# EAGLE design Robot arm (EAGLE 7.6.0)
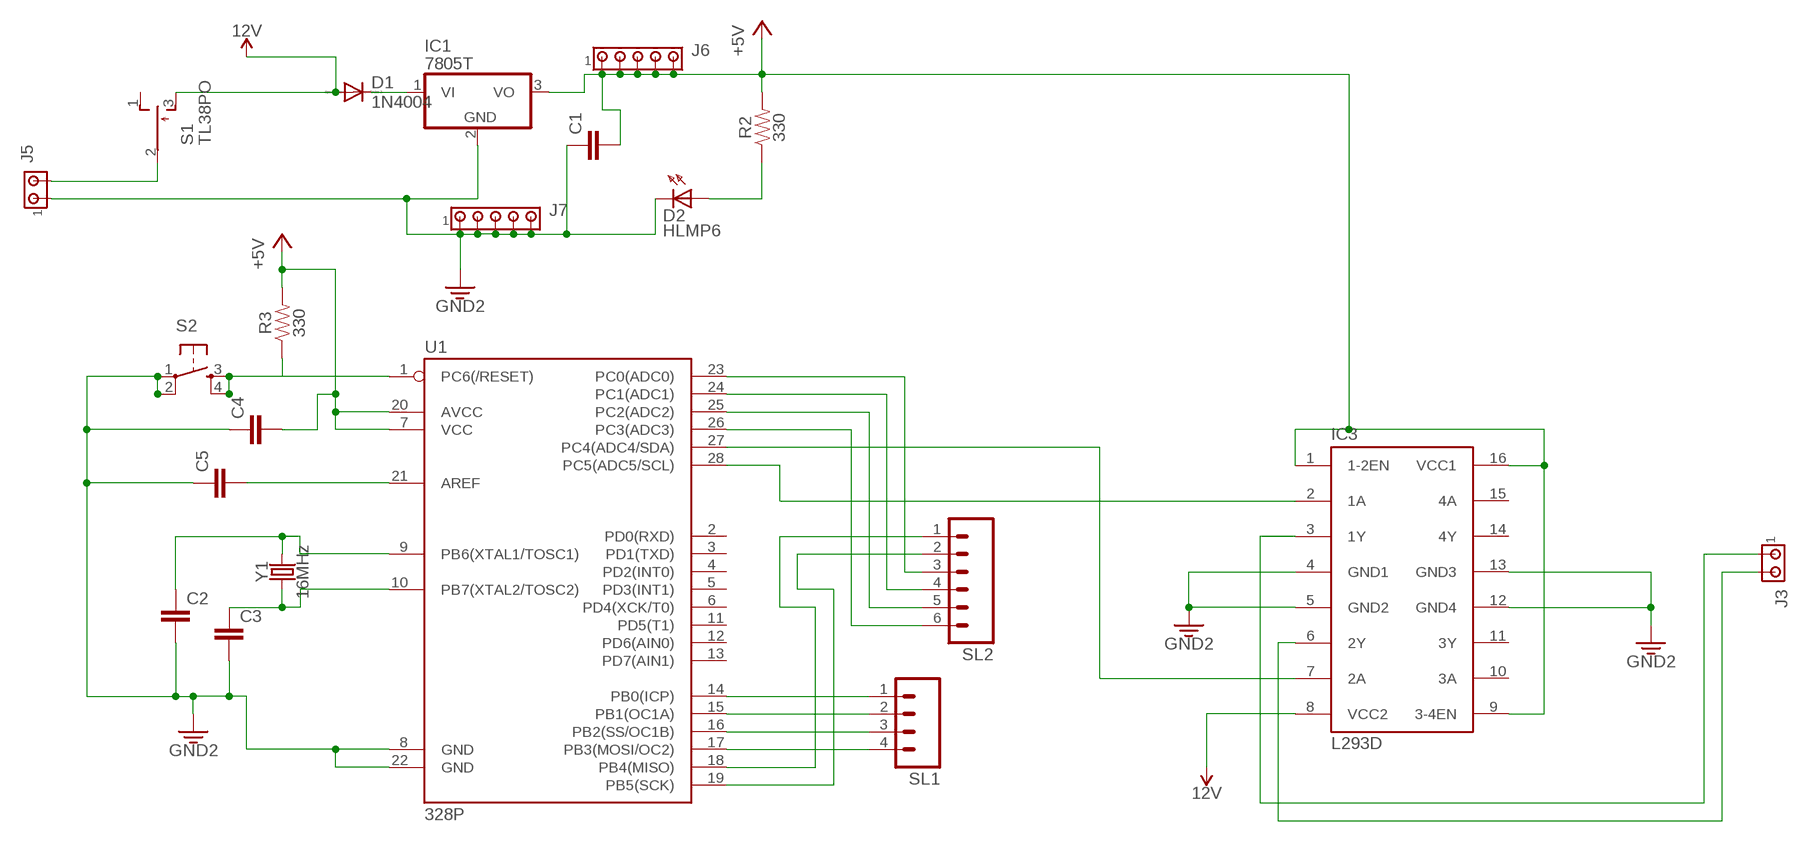
[diagram p0: schematic, sheet 1]

## Parts
C1  C5/2.5  [C5B2.5]
C2  C5/2.5  [C5B2.5]
C3  C5/2.5  [C5B2.5]
C4  C5/2.5  [C5B2.5]
C5  C5/2.5  [C5B2.5]
D1  1N4004  [DO41-10]
D2  HLMP6  [HLMP6]
IC1  7805T  [TO220H]
IC3  L293D  [DIL16]
J3  MTA02-156  [1X2MTA]
J5  MTA02-156  [1X2MTA]
J6  MTA05-100  [10X05MTA]
J7  MTA05-100  [10X05MTA]
R2  330  330OHM-HORIZ-1/10W-5%  [AXIAL-0.3]
R3  330  330OHM-HORIZ-1/10W-5%  [AXIAL-0.3]
S1  TL38PO  [TL3XPO]
S2  TAC_SWITCHPTH  [TACTILE-PTH]
SL1  MA04  [04PA]
SL2  MA06  [06PA]
U1  328P  ATMEGA328P_PDIP  [DIP28]
Y1  16MHz  CRYSTAL-16MHZPTH-HC49US  [HC49US]

## Nets
3.3V: C1.1 C2.2 C3.2 C4.1 C5.1 D2.K IC1.2(GND) IC3.4(GND1) IC3.5(GND2) IC3.12(GND4) IC3.13(GND3) J5.1 J7.1 J7.2 J7.3 J7.4 J7.5 S2.1 S2.2 U1.8(GND) U1.22(GND) ; supply symbol labelled GND2
12V: D1.A IC3.8(VCC2) S1.3(S)
+5V: C1.2 C4.2 IC1.3(VO) IC3.1(1-2EN) IC3.9(3-4EN) IC3.16(VCC1) J6.1 J6.2 J6.3 J6.4 J6.5 R2.P$2 R3.P$2 U1.7(VCC) U1.20(AVCC)
N$1: IC3.7(2A) U1.27(PC4(ADC4/SDA))
N$2: SL1.1 U1.14(PB0(ICP))
N$3: SL1.2 U1.15(PB1(OC1A))
N$4: SL1.3 U1.16(PB2(SS/OC1B))
N$5: SL1.4 U1.17(PB3(MOSI/OC2))
N$6: SL2.3 U1.23(PC0(ADC0))
N$7: D2.A R2.P$1
N$8: IC3.2(1A) U1.28(PC5(ADC5/SCL))
N$9: SL2.4 U1.24(PC1(ADC1))
N$10: R3.P$1 S2.3 S2.4 U1.1(PC6(/RESET))
N$11: C3.1 U1.10(PB7(XTAL2/TOSC2)) Y1.1
N$12: C5.2 U1.21(AREF)
N$13: IC3.3(1Y) J3.1
N$14: J5.2 S1.2(P)
N$15: IC3.6(2Y) J3.2
N$16: D1.C IC1.1(VI)
N$17: SL2.5 U1.25(PC2(ADC2))
N$18: SL2.6 U1.26(PC3(ADC3))
N$19: SL2.1 U1.18(PB4(MISO))
N$20: SL2.2 U1.19(PB5(SCK))
N$24: C2.1 U1.9(PB6(XTAL1/TOSC1)) Y1.2
Unconnected: IC3.10(3A) IC3.11(3Y) IC3.14(4Y) IC3.15(4A) S1.1(O) U1.2(PD0(RXD)) U1.3(PD1(TXD)) U1.4(PD2(INT0)) U1.5(PD3(INT1)) U1.6(PD4(XCK/T0)) U1.11(PD5(T1)) U1.12(PD6(AIN0)) U1.13(PD7(AIN1))

## Library data of the parts
C1-C5 = capacitor-wima:C: CAPACITOR naming: grid - package width
D1 = diode:1N4004: DIODE general purpose rectifier, 1 A
D2 = display-hp:HLMP6: LED 2mm horizontal; MF: AGILENT TECHNOLOGIES; MPN: HLMP-6500; OC_FARNELL: 1652490; OC_NEWARK: 40K0088
IC1 = linear:78*: Positive VOLTAGE REGULATOR Source: http://cache.national.com/ds/LM/LM78L05.pdf http://www.fairchildsemi.com/ds/LM/LM7805.pdf
IC3 = st-microelectronics:L293D: PUSH-PULL 4 CHANNEL DRIVER; MPN: L293D; OC_FARNELL: 9589619; OC_NEWARK: 56P8249
J3 J5 = con-amp:MTA02-156: AMP connector
J6 J7 = con-amp:MTA05-100: AMP connector
R2 R3 = SparkFun-Resistors:330OHM: 330Ω resistor A resistor is a passive two-terminal electrical component that implements electrical resistance as a circuit element. Resistors act to reduce current flow, and, at the same time, act to lower voltage levels within circuits. - Wikipedia; PROD_ID: RES-8371
S1 = switch:TL38PO: TINY SWITCH ON OFF MOM Source: http://www2.produktinfo.conrad.com/datenblaetter/700000-724999/705152-da-01-de-Subminiaturschalter_TL_36YO.pdf
S2 = SparkFun-Retired:TAC_SWITCH: Momentary Switch Button commonly used for reset or general input. Spark Fun Electronics SKU : COM-00097 SMT- SWCH-08247
SL1 = con-amp-quick:MA04: AMP QUICK CONNECTOR; OC_FARNELL: unknown; OC_NEWARK: unknown
SL2 = con-amp-quick:MA06: AMP QUICK CONNECTOR; OC_FARNELL: unknown; OC_NEWARK: unknown
U1 = SparkFun-IC-Microcontroller:ATMEGA328P_PDIP: Atmel 328P Through hole ATMEGA328P uC used in the Arduino 32kb flash, 1k EEPROM, 2k SRAM Datasheet <http://www.sparkfun.com/datasheets/Components/SMD/ATMega328.pdf> SparkFun Products Storefront component: AVR 28 Pin 20MHz 32K 6A/D - ATMega328P <https://www.sparkfun.com/products/9061> (COM-09061) SparkFun Simon Says - Through-Hole Soldering Kit <https://www.sparkfun.com/products/10547> (KIT-10547) SparkFun Learn to Solder - Simon Says <https://www.sparkfun.com/products/13708> (KIT-13708) SparkFun BigTime Watch Kit <https://www.sparkfun.com/products/11734> (KIT-11734) SparkFun ClockIt <https://www.sparkfun.com/products/10930> (KIT-10930) SparkFun Serial Enabled LCD Kit <https://www.sparkfun.com/products/10097> (LCD-10097) SparkFun Simon Tilts - Through Hole Soldering Kit <https://www.sparkfun.com/products/12634> (KIT-12634) SparkFun Frequency Counter Kit <https://www.sparkfun.com/products/10140> (KIT-10140) FabFM Radio Kit <https://www.sparkfun.com/products/11043> (KIT-11043) SparkFun Binary Blaster Kit <https://www.sparkfun.com/products/12037> (KIT-12037) SparkFun Metro-Gnome <https://www.sparkfun.com/products/9236> (KIT-09236) ATmega328 with Arduino Optiboot (Uno) <https://www.sparkfun.com/products/10524> (DEV-10524); PROD_ID: IC-09136
Y1 = SparkFun-Clocks:CRYSTAL-16MHZ: 16MHz Crystal Digikey Example <http://www.digikey.com/product-search/en?keywords=535-9122-1-ND> Frequency: 16MHz Frequency Stability: ±50ppm Frequency Tolerance: ±20ppm Load Capacitance: 18pF SparkFun Products: Pro Micro -5V/16MHz <https://www.sparkfun.com/products/12640> SparkFun Serial Enabled LCD Kit <https://www.sparkfun.com/products/10097>; PROD_ID: XTAL-08181; SF_ID: COM-00536

## Board
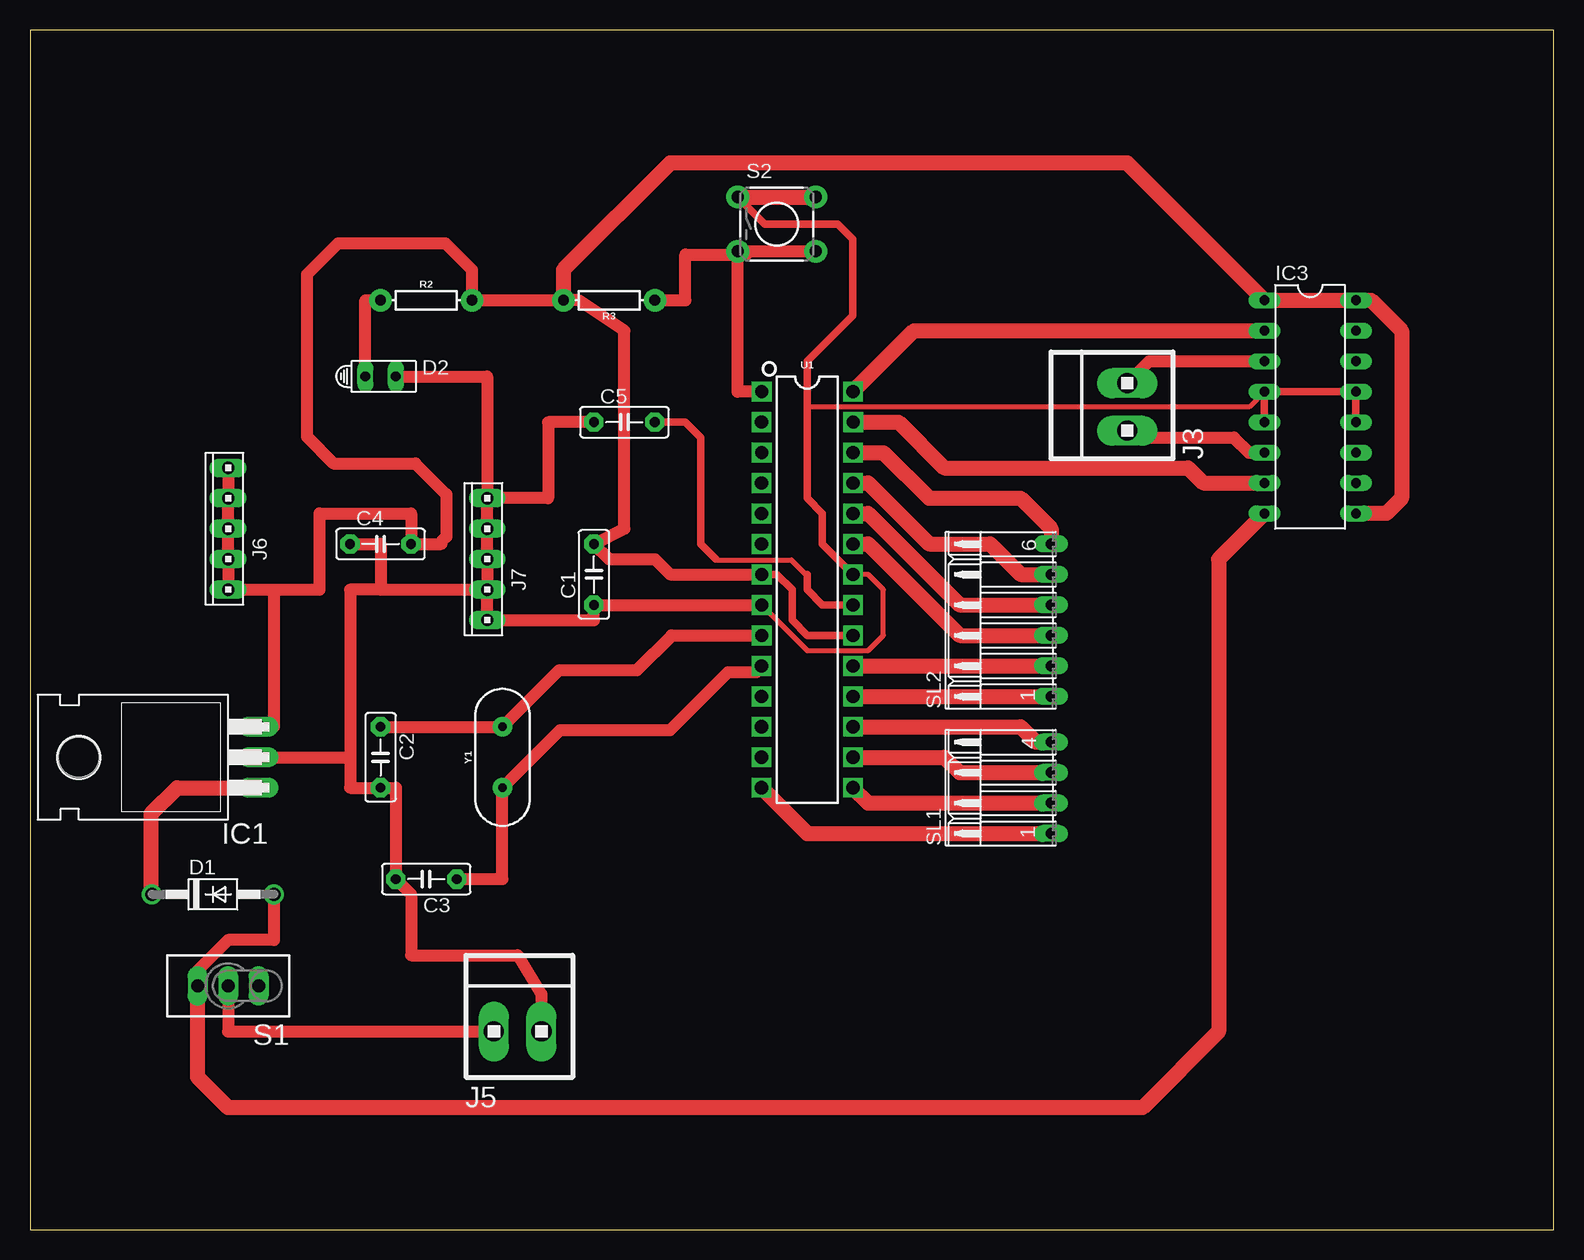
[diagram p1: board, top side]
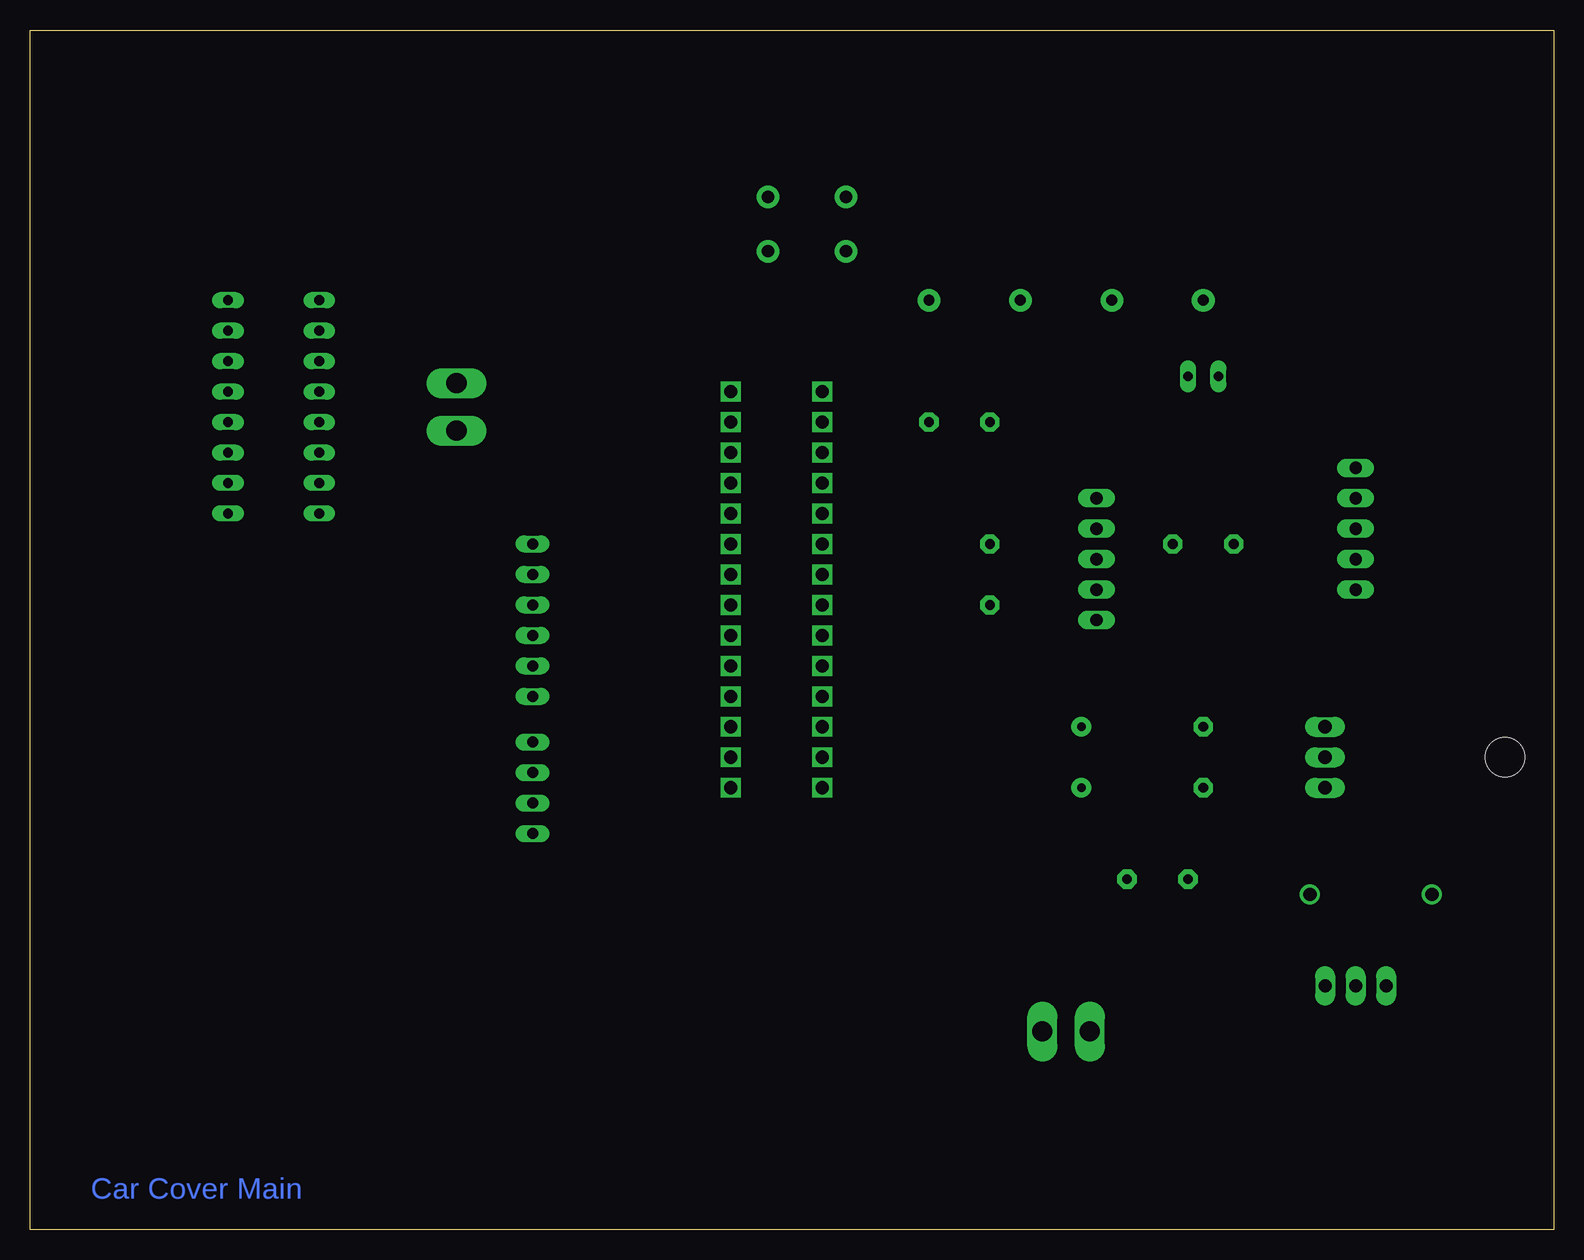
[diagram p2: board, bottom side, seen from below]

Size 126.98 x 100 mm. Coordinates in mm from the lower left corner, seen from the top.
Outline: 0,0 126.98,0 126.98,100 0,100 0,0
Copper layers (1*16): Top 0.035mm / dielectric 1.5mm / Bottom 0.035mm
Design rules "default": minimum track width 10mil, minimum drill 24mil, track to track 8mil, track to pad 8mil, pad to pad 8mil, via to via 8mil, smd to smd 8mil, copper to edge 40mil, drill to drill 8mil, minimum pad ring 10mil, minimum via ring 8mil, stop-mask expansion 4mil, vias tented up to drill 0mil, thermal gap 10mil

### Footprints (pad centres in the part's own frame; a part is rotated, then mirrored left to right if it is on the bottom)
C5B2.5 = drill 0.813 pad 1.6 octagon: 1 -2.54,0; 2 2.54,0
DO41-10 = drill 1.118: A 5.08,0; C -5.08,0
HLMP6 = drill 0.813 long: A -1.27,0; K 1.27,0
TO220H = drill 1.118 long: 1 -2.54,-10.16; 2 0,-10.16; 3 2.54,-10.16 | hole 3.302: 0,4.826
DIL16 = drill 0.813 long: 1 -8.89,-3.81; 2 -6.35,-3.81; 3 -3.81,-3.81; 4 -1.27,-3.81; 5 1.27,-3.81; 6 3.81,-3.81; 7 6.35,-3.81; 8 8.89,-3.81; 9 8.89,3.81; 10 6.35,3.81; 11 3.81,3.81; 12 1.27,3.81; 13 -1.27,3.81; 14 -3.81,3.81; 15 -6.35,3.81; 16 -8.89,3.81
1X2MTA = drill 1.676 long: 1 1.981,0; 2 -1.981,0
10X05MTA = drill 1.016 long: 1 5.08,0; 2 2.54,0; 3 0,0; 4 -2.54,0; 5 -5.08,0
AXIAL-0.3 = drill 0.9 pad 1.88: P$1 -3.81,0; P$2 3.81,0
TL3XPO = drill 1.1 pad 1.422 long: 1 -2.54,0; 2 0,0; 3 2.54,0
TACTILE-PTH = drill 1.016 pad 1.88: 1 -3.251,2.261; 2 3.251,2.261; 3 -3.251,-2.261; 4 3.251,-2.261
04PA = drill 0.914 long: 1 -3.81,0; 2 -1.27,0; 3 1.27,0; 4 3.81,0
06PA = drill 0.914 long: 1 -6.35,0; 2 -3.81,0; 3 -1.27,0; 4 1.27,0; 5 3.81,0; 6 6.35,0
DIP28 = drill 0.813 pad 1.626: 1 -16.51,-3.81; 2 -13.97,-3.81; 3 -11.43,-3.81; 4 -8.89,-3.81; 5 -6.35,-3.81; 6 -3.81,-3.81; 7 -1.27,-3.81; 8 1.27,-3.81; 9 3.81,-3.81; 10 6.35,-3.81; 11 8.89,-3.81; 12 11.43,-3.81; 13 13.97,-3.81; 14 16.51,-3.81; 15 16.51,3.81; 16 13.97,3.81; 17 11.43,3.81; 18 8.89,3.81; 19 6.35,3.81; 20 3.81,3.81; 21 1.27,3.81; 22 -1.27,3.81; 23 -3.81,3.81; 24 -6.35,3.81; 25 -8.89,3.81; 26 -11.43,3.81; 27 -13.97,3.81; 28 -16.51,3.81
HC49US = drill 0.7 pad 1.651: 1 -2.54,0; 2 2.54,0

### Placement (x,y rotation side)
C1  46.99,54.61 90 top
C2  29.21,39.37 270 top
C3  33.02,29.21 180 top
C4  29.21,57.15 0 top
C5  49.53,67.31 0 top
D1  15.24,27.94 0 top
D2  29.21,71.12 0 top
IC1  8.89,39.37 90 top
IC3  106.68,68.58 270 top
J3  91.44,68.58 90 top
J5  40.64,16.51 0 top
J6  16.51,58.42 90 top
J7  38.1,55.88 90 top
R2  33.02,77.47 0 top
R3  48.26,77.47 180 top
S1  16.51,20.32 180 top
S2  62.23,83.82 0 top
SL1  85.09,36.83 90 top
SL2  85.09,50.8 90 top
U1  64.77,53.34 270 top
Y1  39.37,39.37 90 top

### Tracks (layer width: path | path; a pad name or v marks a point on that pad's centre or on a via)
3.3V
  Top 0.406: IC3.4 101.6,68.58 64.77,68.58 | U1.8 64.77,48.26 69.85,48.26 71.12,49.53 71.12,53.34 69.85,54.61 U1.22
  Top 0.61: IC3.5 IC3.4 IC3.13 IC3.12 | S2.1 61.24,83.82 67.31,83.82 68.58,82.55 68.58,76.2 64.77,72.39 64.77,68.58 64.77,60.96 66.04,59.69 66.04,57.15 U1.22
  Top 1.016: C4.1 29.21,57.15 29.21,53.34 | 29.21,53.34 J7.4 | J7.4 J7.5 46.99,50.8 C1.1 U1.8 | J7.4 J7.3 J7.2 J7.1 | IC1.2 26.67,39.37 | 26.67,39.37 26.67,36.83 C2.2 30.48,36.83 C3.2 31.75,27.94 31.75,22.86 40.64,22.86 42.62,19.61 J5.1 | 29.21,53.34 26.67,53.34 26.67,39.37 | D2.K 38.1,71.12 J7.1 | C5.1 43.18,67.31 43.18,60.96 J7.1
  Top 1.27: S2.1 S2.2
12V
  Top 1.016: D1.A 20.32,24.13 16.51,24.13 13.97,21.59 S1.3
  Top 1.27: IC3.8 99.06,55.88 99.06,16.51 92.71,10.16 16.51,10.16 13.97,12.7 S1.3
+5V
  Top 0.61: U1.7 62.23,54.61 63.5,53.34 63.5,50.8 64.77,49.53 U1.20
  Top 1.016: J6.1 J6.2 J6.3 J6.4 J6.5 20.32,53.34 | 20.32,53.34 24.13,53.34 24.13,59.69 31.75,59.69 C4.2 34.29,57.15 34.29,57.35 34.7,57.76 34.7,61.28 32.11,63.87 25.29,63.87 23.06,66.09 23.06,79.62 25.65,82.2 34.63,82.2 36.83,80.01 R2.P$2 R3.P$2 45.72,77.47 49.53,74.93 49.53,58.42 C1.2 48.26,55.88 52.07,55.88 53.34,54.61 U1.7 | 20.32,53.34 20.32,41.91 IC1.3
  Top 1.27: R3.P$2 44.45,80.01 53.34,88.9 91.44,88.9 IC3.1 IC3.16 111.76,77.47 114.3,74.93 114.3,60.96 113.03,59.69 IC3.9
N$1
  Top 1.27: U1.27 72.39,67.31 76.2,63.5 96.52,63.5 97.79,62.23 IC3.7
N$2
  Top 1.27: U1.14 64.77,33.02 SL1.1
N$3
  Top 1.27: U1.15 69.85,35.56 SL1.2
N$4
  Top 1.27: U1.16 76.2,39.37 77.47,38.1 SL1.3
N$5
  Top 1.27: U1.17 82.55,41.91 83.82,40.64 SL1.4
N$6
  Top 1.27: U1.23 69.85,57.15 77.47,49.53 SL2.3
N$7
  Top 1.016: D2.A 27.94,77.47 R2.P$1
N$8
  Top 1.27: U1.28 73.66,74.93 IC3.2
N$9
  Top 1.27: U1.24 69.85,59.69 77.47,52.07 SL2.4
N$10
  Top 1.016: U1.1 58.98,69.85 S2.3 | R3.P$1 54.61,77.47 54.61,81.28 58.98,81.28 | 59.69,81.28 58.98,81.28 | 58.98,81.28 S2.3 | S2.3 S2.4
N$11
  Top 1.016: C3.1 39.37,29.21 Y1.1 44.19,41.64 53.35,41.64 58.17,46.46 60.55,46.46 60.96,46.86 U1.10
N$12
  Top 0.406: 57.15,55.88 57.2,55.83 63.44,55.83 64.67,54.61 64.77,54.61
  Top 0.61: C5.2 54.61,67.31 55.88,66.04 55.88,57.15 57.15,55.88 | 64.77,54.61 64.77,53.34 66.04,52.07 U1.21
N$13
  Top 1.016: J3.1 93.27,72.39 IC3.3
N$14
  Top 1.016: S1.2 16.51,16.51 J5.2
N$15
  Top 1.016: J3.2 92,66.04 100.33,66.04 101.6,64.77 IC3.6
N$16
  Top 1.27: D1.C 10.09,28.01 10.09,34.67 12.26,36.83 IC1.1
N$17
  Top 1.27: U1.25 69.85,62.23 74.93,57.15 80.01,57.15 82.55,54.61 SL2.5
N$18
  Top 1.27: U1.26 71.12,64.77 74.93,60.96 82.55,60.96 85.09,58.42 SL2.6
N$19
  Top 1.27: U1.18 SL2.1
N$20
  Top 1.27: U1.19 SL2.2
N$21  (via drill 1.1)
  other vias: 68.58,69.85
N$22  (via drill 1.1)
  other vias: 68.59,67.3
N$23  (via drill 1.1)
  other vias: 68.59,64.76
N$24
  Top 1.016: C2.1 Y1.2 44.1,46.64 50.58,46.64 53.47,49.53 U1.9
N$25  (via drill 1.1)
  other vias: 68.59,62.24
N$26  (via drill 1.1)
  other vias: 68.58,59.69
N$27  (via drill 1.1)
  other vias: 68.58,57.15
N$28  (via drill 1.1)
  other vias: 68.59,54.6
N$29  (via drill 1.1)
  other vias: 68.59,52.07
N$30  (via drill 1.1)
  other vias: 68.58,49.53
N$31  (via drill 1.1)
  other vias: 68.58,46.99
N$32  (via drill 1.1)
  other vias: 68.58,44.44
N$33  (via drill 1.1)
  other vias: 68.59,41.91
N$34  (via drill 1.1)
  other vias: 68.58,39.37
N$35  (via drill 1.1)
  other vias: 68.58,36.84
N$36  (via drill 1.1)
  other vias: 60.95,36.83
N$37  (via drill 1.1)
  other vias: 60.96,39.37
N$38  (via drill 1.1)
  other vias: 60.96,41.91
N$39  (via drill 1.1)
  other vias: 60.97,44.44
N$40  (via drill 1.1)
  other vias: 60.96,46.99
N$41  (via drill 1.1)
  other vias: 60.97,49.53
N$42  (via drill 1.1)
  other vias: 60.97,52.06
N$43  (via drill 1.1)
  other vias: 60.97,54.6
N$44  (via drill 1.1)
  other vias: 60.96,57.16
N$45  (via drill 1.1)
  other vias: 60.96,59.69
N$46  (via drill 1.1)
  other vias: 60.96,62.23
N$47  (via drill 1.1)
  other vias: 60.97,64.76
N$48  (via drill 1.1)
  other vias: 60.97,67.31
N$49  (via drill 1.1)
  other vias: 60.97,69.84

### Text on the board
Bottom: Car Cover Main